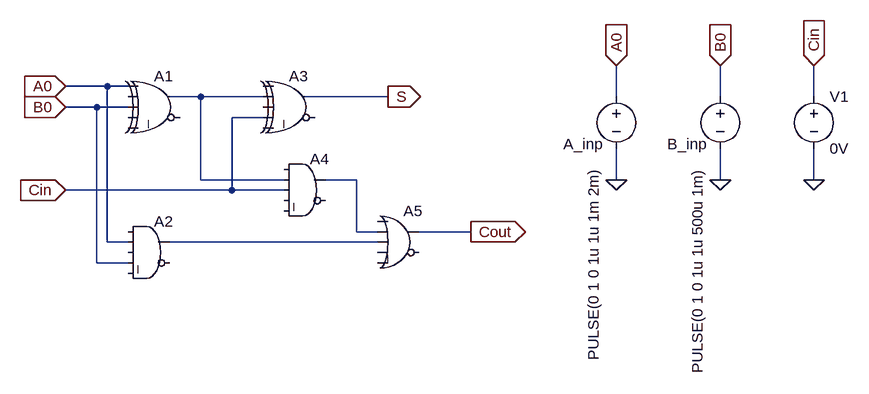
[diagram p0: schematic FullAdder.asc]
FullAdder.asc, the LTspice schematic file:
Version 4
SHEET 1 1452 720
WIRE 112 64 48 64
WIRE 144 64 112 64
WIRE 256 80 208 80
WIRE 352 80 256 80
WIRE 544 80 416 80
WIRE 896 80 896 32
WIRE 1056 80 1056 32
WIRE 1200 80 1200 32
WIRE 96 96 48 96
WIRE 144 96 96 96
WIRE 352 112 304 112
WIRE 256 208 256 80
WIRE 384 208 256 208
WIRE 496 208 448 208
WIRE 896 208 896 160
WIRE 1056 208 1056 160
WIRE 1200 208 1200 160
WIRE 304 224 304 112
WIRE 304 224 48 224
WIRE 384 224 304 224
WIRE 496 288 496 208
WIRE 528 288 496 288
WIRE 672 288 592 288
WIRE 112 304 112 64
WIRE 144 304 112 304
WIRE 528 304 208 304
WIRE 96 336 96 96
WIRE 144 336 96 336
FLAG 48 64 A0
IOPIN 48 64 In
FLAG 48 96 B0
IOPIN 48 96 In
FLAG 896 208 0
FLAG 896 32 A0
IOPIN 896 32 In
FLAG 1056 208 0
FLAG 1056 32 B0
IOPIN 1056 32 In
FLAG 48 224 Cin
IOPIN 48 224 In
FLAG 544 80 S
IOPIN 544 80 Out
FLAG 672 288 Cout
IOPIN 672 288 Out
FLAG 1200 208 0
FLAG 1200 32 Cin
IOPIN 1200 32 In
SYMBOL Digital\\xor 192 32 R0
SYMATTR InstName A1
SYMBOL Digital\\and 176 256 R0
SYMATTR InstName A2
SYMBOL voltage 896 64 R0
WINDOW 0 -82 89 Left 2
WINDOW 3 -35 125 VRight 2
WINDOW 123 0 0 Left 0
WINDOW 39 0 0 Left 0
SYMATTR InstName A_inp
SYMATTR Value PULSE(0 1 0 1u 1u 1m 2m)
SYMBOL voltage 1056 64 R0
WINDOW 0 -82 89 Left 2
WINDOW 3 -35 125 VRight 2
WINDOW 123 0 0 Left 0
WINDOW 39 0 0 Left 0
SYMATTR InstName B_inp
SYMATTR Value PULSE(0 1 0 1u 1u 500u 1m)
SYMBOL Digital\\xor 400 32 R0
SYMATTR InstName A3
SYMBOL Digital\\and 416 160 R0
SYMATTR InstName A4
SYMBOL Digital\\or 560 240 R0
SYMATTR InstName A5
SYMBOL voltage 1200 64 R0
WINDOW 123 0 0 Left 0
WINDOW 39 0 0 Left 0
SYMATTR InstName V1
SYMATTR Value 0V

The netlist it stands for:
* FullAdder.asc
A1 A0 0 B0 0 0 0 N001 0 XOR
A2 0 A0 0 B0 0 0 N003 0 AND
V§A_inp A0 0 PULSE(0 1 0 1u 1u 1m 2m)
V§B_inp B0 0 PULSE(0 1 0 1u 1u 500u 1m)
A3 0 N001 0 Cin 0 0 S 0 XOR
A4 0 N001 Cin 0 0 0 N002 0 AND
A5 0 N002 N003 0 0 0 Cout 0 OR
V1 Cin 0 0V
.backanno
.end